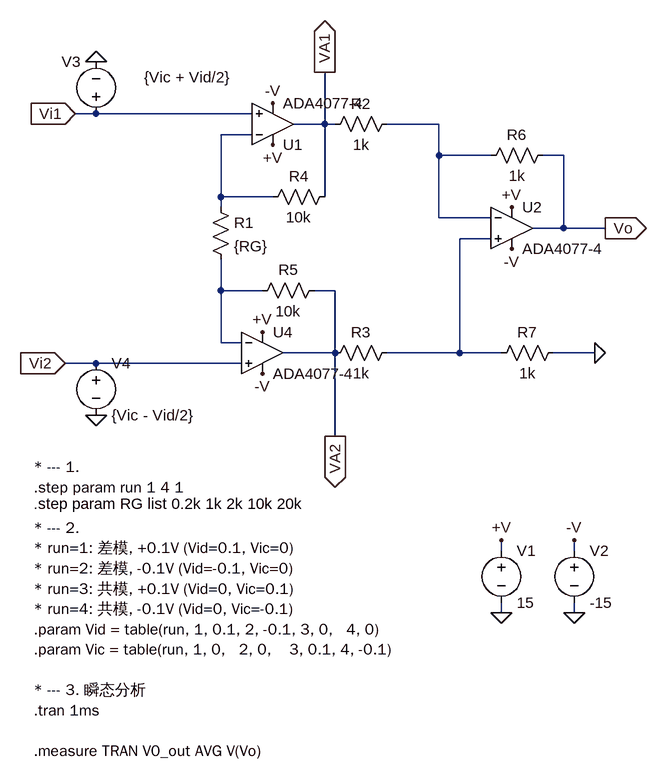
[diagram p0: schematic InstrumentationAmplifierCircuit_dif_com_input.asc]
InstrumentationAmplifierCircuit_dif_com_input.asc, the LTspice schematic file:
Version 4.1
SHEET 1 880 680
WIRE -1024 -416 -1056 -416
WIRE -784 -416 -1024 -416
WIRE -672 -400 -672 -480
WIRE -672 -400 -720 -400
WIRE -656 -400 -672 -400
WIRE -496 -400 -576 -400
WIRE -784 -384 -832 -384
WIRE -496 -352 -496 -400
WIRE -416 -352 -496 -352
WIRE -304 -352 -336 -352
WIRE -832 -288 -832 -384
WIRE -752 -288 -832 -288
WIRE -672 -288 -672 -400
WIRE -832 -272 -832 -288
WIRE -496 -256 -496 -352
WIRE -416 -256 -496 -256
WIRE -304 -240 -304 -352
WIRE -304 -240 -352 -240
WIRE -240 -240 -304 -240
WIRE -416 -224 -464 -224
WIRE -832 -144 -832 -192
WIRE -768 -144 -832 -144
WIRE -656 -144 -688 -144
WIRE -832 -64 -832 -144
WIRE -800 -64 -832 -64
WIRE -656 -48 -656 -144
WIRE -656 -48 -736 -48
WIRE -464 -48 -464 -224
WIRE -464 -48 -576 -48
WIRE -400 -48 -464 -48
WIRE -256 -48 -320 -48
WIRE -1024 -32 -1072 -32
WIRE -800 -32 -1024 -32
WIRE -656 80 -656 -48
WIRE -400 256 -400 240
WIRE -288 256 -288 240
WIRE -400 352 -400 336
WIRE -288 352 -288 336
FLAG -400 240 +V
FLAG -400 352 0
FLAG -752 -368 +V
FLAG -288 240 -V
FLAG -752 -432 -V
FLAG -288 352 0
FLAG -768 -80 +V
FLAG -768 -16 -V
FLAG -384 -272 +V
FLAG -384 -208 -V
FLAG -240 -240 Vo
IOPIN -240 -240 Out
FLAG -256 -48 0
FLAG -672 -480 VA1
IOPIN -672 -480 Out
FLAG -656 80 VA2
IOPIN -656 80 Out
FLAG -1024 -496 0
FLAG -1024 48 0
FLAG -1072 -32 Vi2
IOPIN -1072 -32 In
FLAG -1056 -416 Vi1
IOPIN -1056 -416 In
SYMBOL voltage -400 240 R0
WINDOW 123 0 0 Left 2
WINDOW 39 0 0 Left 2
SYMATTR InstName V1
SYMATTR Value 15
SYMBOL voltage -288 240 R0
WINDOW 123 24 146 Left 2
WINDOW 39 24 125 Left 2
SYMATTR InstName V2
SYMATTR Value -15
SYMBOL res -848 -288 R0
SYMATTR InstName R1
SYMATTR Value {RG}
SYMBOL res -560 -416 R90
WINDOW 0 0 56 VBottom 2
WINDOW 3 32 56 VTop 2
SYMATTR InstName R2
SYMATTR Value 1k
SYMBOL res -560 -64 R90
WINDOW 0 0 56 VBottom 2
WINDOW 3 32 56 VTop 2
SYMATTR InstName R3
SYMATTR Value 1k
SYMBOL res -656 -304 R90
WINDOW 0 0 56 VBottom 2
WINDOW 3 32 56 VTop 2
SYMATTR InstName R4
SYMATTR Value 10k
SYMBOL res -672 -160 R90
WINDOW 0 0 56 VBottom 2
WINDOW 3 32 56 VTop 2
SYMATTR InstName R5
SYMATTR Value 10k
SYMBOL res -320 -368 R90
WINDOW 0 0 56 VBottom 2
WINDOW 3 32 56 VTop 2
SYMATTR InstName R6
SYMATTR Value 1k
SYMBOL res -304 -64 R90
WINDOW 0 0 56 VBottom 2
WINDOW 3 32 56 VTop 2
SYMATTR InstName R7
SYMATTR Value 1k
SYMBOL voltage -1024 -400 R180
WINDOW 0 24 96 Left 2
WINDOW 3 -206 72 Left 2
WINDOW 123 0 0 Left 0
WINDOW 39 0 0 Left 0
SYMATTR InstName V3
SYMATTR Value {Vic + Vid/2}
SYMBOL voltage -1024 -48 R0
WINDOW 123 0 0 Left 0
WINDOW 39 0 0 Left 0
SYMATTR InstName V4
SYMATTR Value {Vic - Vid/2}
SYMBOL OpAmps\\ADA4077-4 -768 -112 R0
SYMATTR InstName U4
SYMBOL OpAmps\\ADA4077-4 -752 -336 M180
SYMATTR InstName U1
SYMBOL OpAmps\\ADA4077-4 -384 -304 R0
SYMATTR InstName U2
TEXT -1120 184 Left 2 !.step param RG list 0.2k 1k 2k 10k 20k
TEXT -1120 128 Left 2 !* --- 1. \n.step param run 1 4 1\n \n* --- 2. \n* run=1: 差模, +0.1V (Vid=0.1, Vic=0)\n* run=2: 差模, -0.1V (Vid=-0.1, Vic=0)\n* run=3: 共模, +0.1V (Vid=0, Vic=0.1)\n* run=4: 共模, -0.1V (Vid=0, Vic=-0.1)\n.param Vid = table(run, 1, 0.1, 2, -0.1, 3, 0,   4, 0)\n.param Vic = table(run, 1, 0,   2, 0,    3, 0.1, 4, -0.1)\n \n* --- 3. 瞬态分析\n.tran 1ms\n \n.measure TRAN V0_out AVG V(Vo)

The netlist it stands for:
* InstrumentationAmplifierCircuit_dif_com_input.asc
V1 +V 0 15
V2 -V 0 -15
R1 N002 N004 {RG}
R2 N001 VA1 1k
R3 N003 VA2 1k
R4 VA1 N002 10k
R5 VA2 N004 10k
R6 Vo N001 1k
R7 0 N003 1k
V3 Vi1 0 {Vic + Vid/2}
V4 Vi2 0 {Vic - Vid/2}
X§U4 Vi2 N004 +V -V VA2 ADA4077-4  ; pins In+ In- V+ V- OUT
X§U1 Vi1 N002 +V -V VA1 ADA4077-4  ; pins In+ In- V+ V- OUT
X§U2 N003 N001 +V -V Vo ADA4077-4  ; pins In+ In- V+ V- OUT
.step param RG list 0.2k 1k 2k 10k 20k
* --- 1.
.step param run 1 4 1
* --- 2.
* run=1: 差模, +0.1V (Vid=0.1, Vic=0)
* run=2: 差模, -0.1V (Vid=-0.1, Vic=0)
* run=3: 共模, +0.1V (Vid=0, Vic=0.1)
* run=4: 共模, -0.1V (Vid=0, Vic=-0.1)
.param Vid = table(run, 1, 0.1, 2, -0.1, 3, 0,   4, 0)
.param Vic = table(run, 1, 0,   2, 0,    3, 0.1, 4, -0.1)
* --- 3. 瞬态分析
.tran 1ms
.measure TRAN V0_out AVG V(Vo)
.backanno
.end